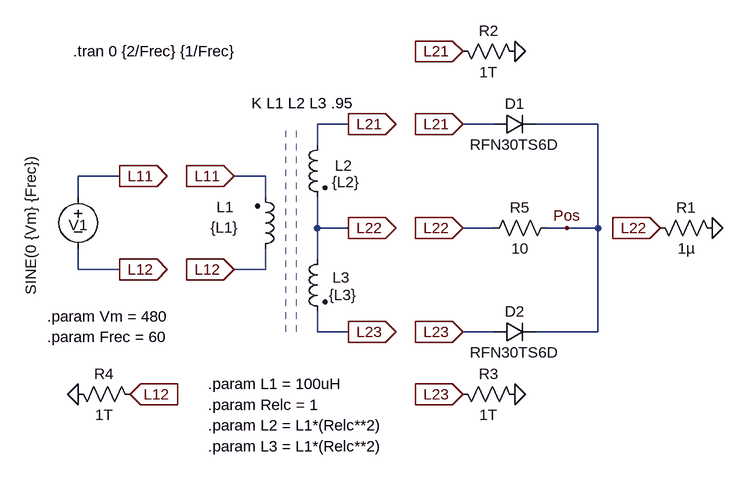
[diagram p0: schematic Draft5.asc]
Draft5.asc, the LTspice schematic file:
Version 4
SHEET 1 964 680
WIRE 384 -192 336 -192
WIRE 608 -192 560 -192
WIRE 768 -192 672 -192
WIRE 336 -160 336 -192
WIRE 32 -112 -32 -112
WIRE 256 -112 208 -112
WIRE -32 -80 -32 -112
WIRE 256 -80 256 -112
WIRE 336 -32 336 -80
WIRE 384 -32 336 -32
WIRE 608 -32 560 -32
WIRE 720 -32 688 -32
WIRE 768 -32 768 -192
WIRE 768 -32 720 -32
WIRE 336 16 336 -32
WIRE -32 32 -32 0
WIRE 32 32 -32 32
WIRE 256 32 256 0
WIRE 256 32 208 32
WIRE 336 128 336 96
WIRE 384 128 336 128
WIRE 608 128 560 128
WIRE 768 128 768 -32
WIRE 768 128 672 128
FLAG 208 -112 L11
IOPIN 208 -112 In
FLAG 208 32 L12
IOPIN 208 32 In
FLAG 384 -192 L21
IOPIN 384 -192 Out
FLAG 32 -112 L11
IOPIN 32 -112 Out
FLAG 384 -32 L22
IOPIN 384 -32 Out
FLAG 384 128 L23
IOPIN 384 128 Out
FLAG 32 32 L12
IOPIN 32 32 Out
FLAG 560 -32 L22
IOPIN 560 -32 In
FLAG 640 -304 0
FLAG 560 -304 L21
IOPIN 560 -304 In
FLAG 640 224 0
FLAG 560 224 L23
IOPIN 560 224 In
FLAG -32 224 0
FLAG 48 224 L12
IOPIN 48 224 In
FLAG 560 -192 L21
IOPIN 560 -192 In
FLAG 560 128 L23
IOPIN 560 128 In
FLAG 944 -32 0
FLAG 864 -32 L22
IOPIN 864 -32 In
FLAG 720 -32 Pos
SYMBOL ind2 240 16 M180
WINDOW 0 -59 80 Left 2
WINDOW 3 -68 49 Left 2
SYMATTR InstName L1
SYMATTR Value {L1}
SYMATTR Type ind
SYMATTR SpiceLine Rser=1
SYMBOL ind2 352 -176 M0
WINDOW 0 -38 48 Left 2
WINDOW 3 -28 73 Center 2
SYMATTR InstName L2
SYMATTR Value {L2}
SYMATTR Type ind
SYMBOL voltage -32 -96 R0
WINDOW 0 -15 59 Left 2
WINDOW 3 -73 59 VCenter 2
WINDOW 123 0 0 Left 2
WINDOW 39 -45 59 VCenter 2
SYMATTR InstName V1
SYMATTR Value SINE(0 {Vm} {Frec})
SYMBOL res 848 -48 M90
WINDOW 0 0 56 VBottom 2
WINDOW 3 32 56 VTop 2
SYMATTR InstName R1
SYMATTR Value 1µ
SYMBOL res 544 -320 M90
WINDOW 0 0 56 VBottom 2
WINDOW 3 32 56 VTop 2
SYMATTR InstName R2
SYMATTR Value 1T
SYMBOL res 544 208 M90
WINDOW 0 0 56 VBottom 2
WINDOW 3 32 56 VTop 2
SYMATTR InstName R3
SYMATTR Value 1T
SYMBOL res 64 240 M270
WINDOW 0 32 56 VTop 2
WINDOW 3 0 56 VBottom 2
SYMATTR InstName R4
SYMATTR Value 1T
SYMBOL diode 608 -176 R270
WINDOW 0 32 32 VTop 2
WINDOW 3 0 32 VBottom 2
SYMATTR InstName D1
SYMATTR Value RFN30TS6D
SYMBOL res 704 -48 R90
WINDOW 0 0 56 VBottom 2
WINDOW 3 32 56 VTop 2
SYMATTR InstName R5
SYMATTR Value 10
SYMBOL diode 608 144 R270
WINDOW 0 32 32 VTop 2
WINDOW 3 0 32 VBottom 2
SYMATTR InstName D2
SYMATTR Value RFN30TS6D
SYMBOL ind2 352 0 M0
WINDOW 0 -34 44 Left 2
WINDOW 3 -24 71 Center 2
SYMATTR InstName L3
SYMATTR Value {L3}
SYMATTR Type ind
TEXT 392 -224 Right 2 !K L1 L2 L3 .95
TEXT -40 -304 Left 2 !.tran 0 {2/Frec} {1/Frec}
TEXT -80 104 Left 2 !.param Vm = 480
TEXT -80 136 Left 2 !.param Frec = 60
TEXT 168 240 Left 2 !.param Relc = 1
TEXT 168 208 Left 2 !.param L1 = 100uH
TEXT 168 272 Left 2 !.param L2 = L1*(Relc**2)
TEXT 168 304 Left 2 !.param L3 = L1*(Relc**2)
LINE Normal 288 128 288 -192 1
LINE Normal 304 128 304 -192 1

The netlist it stands for:
* Draft5.asc
L1 L12 L11 {L1} Rser=1
L2 L21 L22 {L2}
V1 L11 L12 SINE(0 {Vm} {Frec})
R1 L22 0 1µ
R2 L21 0 1T
R3 L23 0 1T
R4 L12 0 1T
D1 L21 Pos RFN30TS6D
R5 Pos L22 10
D2 L23 Pos RFN30TS6D
L3 L22 L23 {L3}
.model D D
.lib standard.dio
K L1 L2 L3 .95
.tran 0 {2/Frec} {1/Frec}
.param Vm = 480
.param Frec = 60
.param Relc = 1
.param L1 = 100uH
.param L2 = L1*(Relc**2)
.param L3 = L1*(Relc**2)
.backanno
.end